# Altium project Spannungsregler.PrjPcb
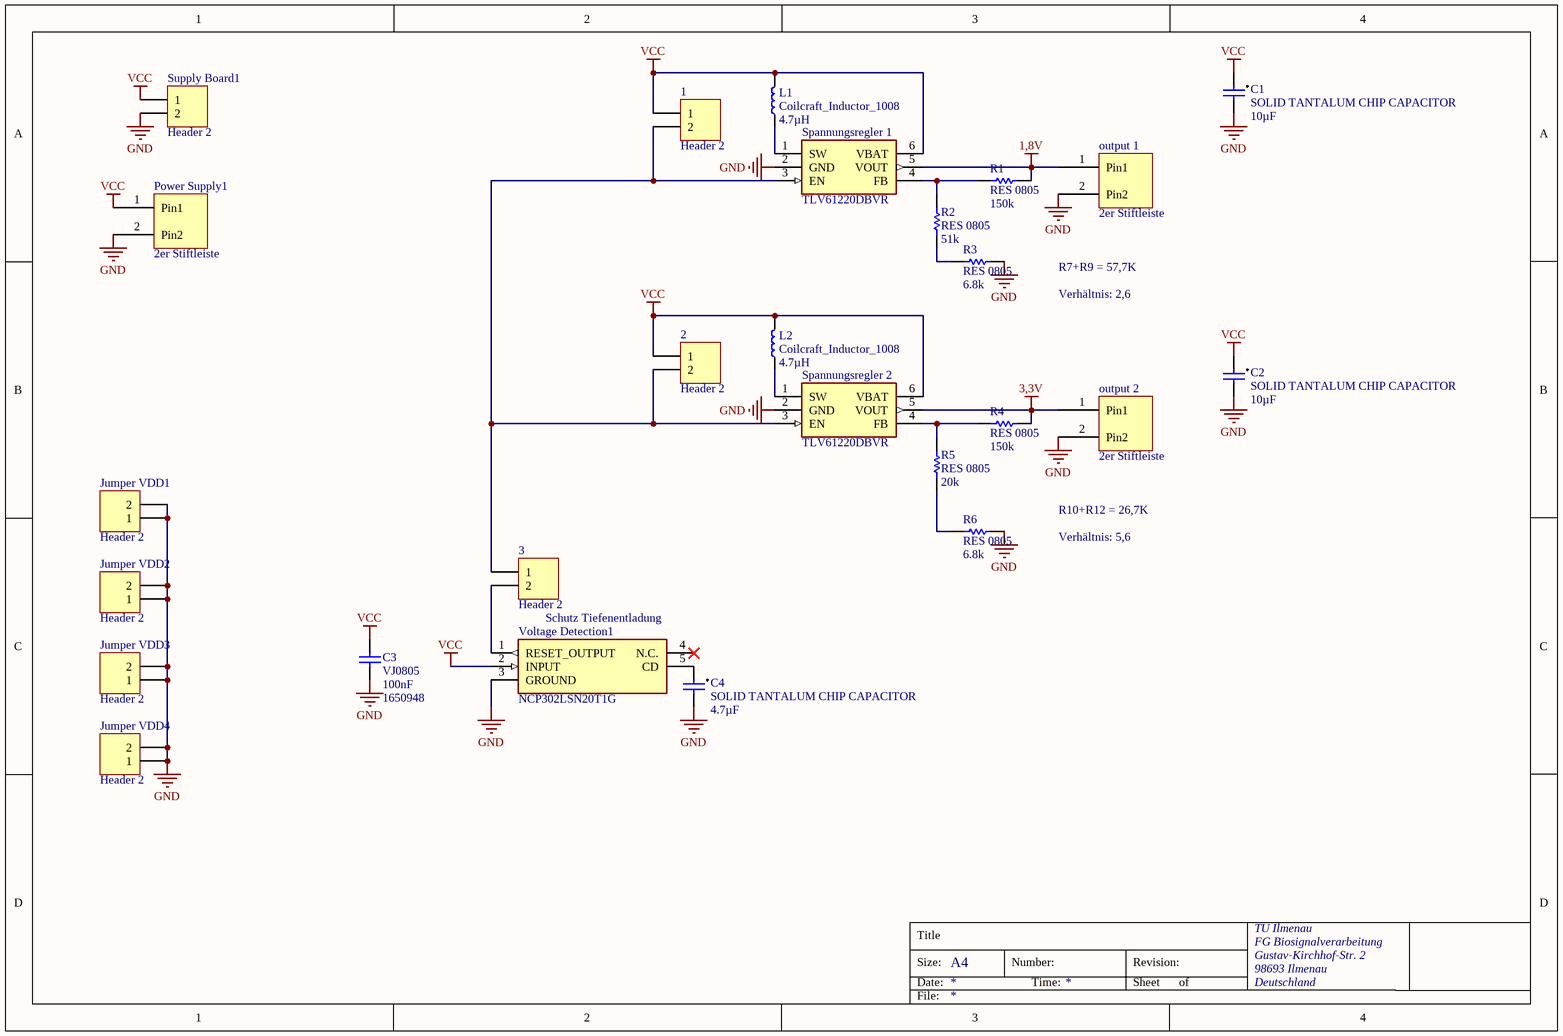
[diagram p0: spannungsregler.SchDoc]
1 sheet, 26 parts. Net scope: global (net labels, ports and power ports of the same name join across sheets).
Board files: Spannungsregler.PcbDoc, Spannungsregler print.PcbDoc

## Sheet spannungsregler.SchDoc
size A4; Organization: Altium Limited; Address1: L3, 12a Rodborough Rd; Address2: Frenchs Forest; Address3: NSW; Address4: Australia 2086

### Parts
1  Header 2  [HDR1X2]
2  Header 2  [HDR1X2]
3  Header 2  [HDR1X2]
C1  SOLID TANTALUM CHIP CAPACITOR  value 10µF  [C, Typ B, Tantal, T491]
C2  SOLID TANTALUM CHIP CAPACITOR  value 10µF  [C, Typ B, Tantal, T491]
C3  VJ0805  value 100nF  Supplier Part Number 1: 1650948  [VJ0805]
C4  SOLID TANTALUM CHIP CAPACITOR  value 4.7µF  [C, Typ B, Tantal, T491]
Jumper_VDD1  Header 2  [HDR1X2]
Jumper_VDD2  Header 2  [HDR1X2]
Jumper_VDD3  Header 2  [HDR1X2]
Jumper_VDD4  Header 2  [HDR1X2]
L1  Coilcraft_Inductor_1008  Parameter 1: 4.7µH  [Coilcraft 1008CS Series]
L2  Coilcraft_Inductor_1008  Parameter 1: 4.7µH  [Coilcraft 1008CS Series]
output_1  2er Stiftleiste  [2er Stiftleiste WR-WTB]
output_2  2er Stiftleiste  [2er Stiftleiste WR-WTB]
Power_Supply1  2er Stiftleiste  [2er Stiftleiste WR-WTB]
R1  RES 0805  value 150k  [D12CRCW0805]
R2  RES 0805  value 51k  [D12CRCW0805]
R3  RES 0805  value 6.8k  [D12CRCW0805]
R4  RES 0805  value 150k  [D12CRCW0805]
R5  RES 0805  value 20k  [D12CRCW0805]
R6  RES 0805  value 6.8k  [D12CRCW0805]
Spannungsregler_1  TLV61220DBVR  [SOT95P280X145-6N]
Spannungsregler_2  TLV61220DBVR  [SOT95P280X145-6N]
Supply_Board1  Header 2  [HDR1X2]
Voltage_Detection1  NCP302LSN20T1G  [SOT95P275X110-5N]

### Nets
1,8V: output_1.1(Pin1) R1.2 Spannungsregler_1.5(VOUT)
3,3V: output_2.1(Pin1) R4.2 Spannungsregler_2.5(VOUT)
GND: C1.2 C2.2 C3.1 C4.2 Jumper_VDD1.1 Jumper_VDD1.2 Jumper_VDD2.1 Jumper_VDD2.2 Jumper_VDD3.1 Jumper_VDD3.2 Jumper_VDD4.1 Jumper_VDD4.2 output_1.2(Pin2) output_2.2(Pin2) Power_Supply1.2(Pin2) R3.1 R6.2 Spannungsregler_1.2(GND) Spannungsregler_2.2(GND) Supply_Board1.2 Voltage_Detection1.3(GROUND)
VCC: 1.1 2.1 C1.1 C2.1 C3.2 L1.2 L2.2 Power_Supply1.1(Pin1) Spannungsregler_1.6(VBAT) Spannungsregler_2.6(VBAT) Supply_Board1.1 Voltage_Detection1.2(INPUT)
Net1_2: 1.2 2.2 3.1 Spannungsregler_1.3(EN) Spannungsregler_2.3(EN)
Net3_2: 3.2 Voltage_Detection1.1(RESET_OUTPUT)
NetC4_1: C4.1 Voltage_Detection1.5(CD)
NetL1_1: L1.1 Spannungsregler_1.1(SW)
NetL2_1: L2.1 Spannungsregler_2.1(SW)
NetR1_1: R1.1 R2.2 Spannungsregler_1.4(FB)
NetR2_1: R2.1 R3.2
NetR4_1: R4.1 R5.2 Spannungsregler_2.4(FB)
NetR5_1: R5.1 R6.1

Not connected (* = marked no-connect by the designer): Voltage_Detection1 4(N.C.)*

### Notes on the sheet
- Verhältnis: 2,6
- R7+R9 = 57,7K
- R10+R12 = 26,7K
- Verhältnis: 5,6
- Schutz Tiefenentladung
- Title
- Size:
- Date:
- A4
- Number:
- Time:
- Revision:
- Sheet
- of
- TU Ilmenau
- FG Biosignalverarbeitung
- Gustav-Kirchhof-Str. 2
- 98693 Ilmenau
- Deutschland
- File:

### Library data of the parts
1-3 Jumper_VDD1-Jumper_VDD4 Supply_Board1 = Header 2: Header, 2-Pin; LatestRevisionDate: 17-Jul-2002; LatestRevisionNote: Re-released for DXP Platform.; Publisher: Altium Limited
C1 C2 C4 = C, Typ B, Tantal, T491, Kemet: Fitted: False
C3 = VJ0805: Ceramic Chip Capacitor Vishay Vitramon; Fitted: False; Supplier 1: Farnell
L1 L2 = Coilcraft_Inductor_1008: Coilcraft 1008
output_1 output_2 Power_Supply1 = 2er Stiftleiste: 2er Stiftleiste WR-WTB 2,54mm
R1-R6 = RES 0805: Chip Resistor 0805; Fitted: False; Supplier 1: Farnell; Supplier Part Number 1: 1738935
Spannungsregler_1 Spannungsregler_2 = TLV61220DBVR: Integrated Circuit; Manufacturer_Name: Texas Instruments; Datasheet Link: http://www.ti.com/lit/gpn/tlv61220; Height: 1.45mm; Mouser2 Part Number: 595-TLV61220DBVR; Mouser2 Price/Stock: https://www.mouser.com/Search/Refine.aspx?Keyword=595-TLV61220DBVR; Manufacturer_Part_Number: TLV61220DBVR
Voltage_Detection1 = NCP302LSN20T1G: Integrated Circuit; Manufacturer_Name: ON Semiconductor; Datasheet Link: http://www.onsemi.com/pub/Collateral/NCP302-D.PDF; Height: 1.1mm; Manufacturer_Part_Number: NCP302LSN20T1G